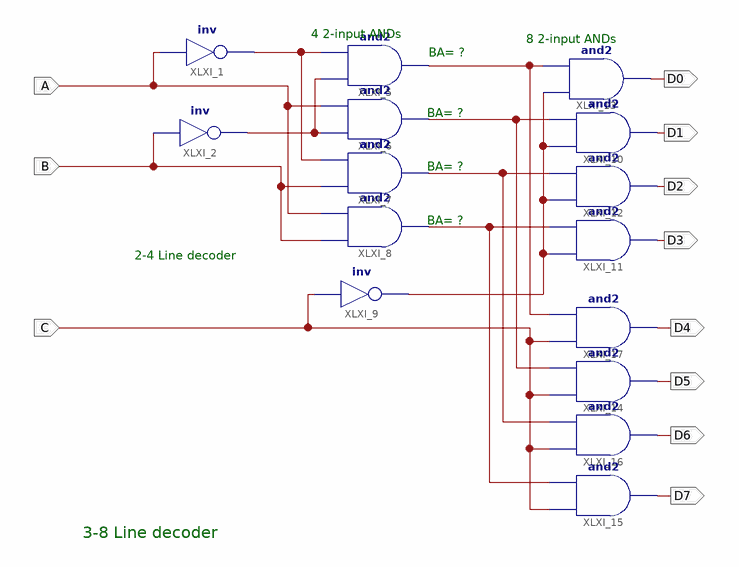
[diagram p0: schematic sheet 1]
// Xilinx ISE schematic Decoder_38.sch (spartan3) as structural Verilog: 15 symbols, 11 ports
module Decoder_38 (
  input  B,
  input  C,
  input  A,
  output D0,
  output D1,
  output D2,
  output D3,
  output D7,
  output D4,
  output D6,
  output D5
);

  wire XLXN_20, XLXN_22, XLXN_24, XLXN_26, XLXN_43, XLXN_79, XLXN_80;

  not XLXI_1 (XLXN_80, A);
  not XLXI_2 (XLXN_79, B);
  and XLXI_5 (XLXN_20, XLXN_79, XLXN_80);
  and XLXI_6 (XLXN_22, XLXN_79, A);
  and XLXI_7 (XLXN_24, B, XLXN_80);
  and XLXI_8 (XLXN_26, B, A);
  not XLXI_9 (XLXN_43, C);
  and XLXI_10 (D1, XLXN_43, XLXN_22);
  and XLXI_11 (D3, XLXN_43, XLXN_26);
  and XLXI_12 (D2, XLXN_43, XLXN_24);
  and XLXI_13 (D0, XLXN_43, XLXN_20);
  and XLXI_17 (D4, C, XLXN_20);
  and XLXI_15 (D7, C, XLXN_26);
  and XLXI_16 (D6, C, XLXN_24);
  and XLXI_14 (D5, C, XLXN_22);

  // Notes on the sheet:
  //   4 2-input ANDs
  //   8 2-input ANDs
  //   BA= ?
  //   BA= ?
  //   BA= ?
  //   BA= ?
  //   2-4 Line decoder
  //   3-8 Line decoder
endmodule
